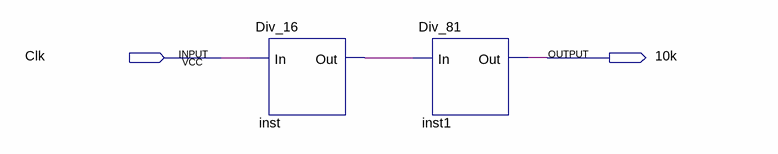
[diagram p0: schematic sheet]
// Quartus schematic Div_1296.bdf as structural Verilog: 2 symbols, 2 pins
module Div_1296 (
  input  Clk,
  output \10k 
);

  wire inst_out;

  Div_16 inst (.In(Clk), .Out(inst_out));
  Div_81 inst1 (.In(inst_out), .Out(\10k ));
endmodule
